# EasyEDA Pro project ProPrj_LED闪烁电路_2025-12-14-09-43-45.epro

# Schematic Schematic1
Board Name: Board1; Create Date: 2025-11-30; Page Name: P1; Project Name: LED闪烁电路; Schematic Name: Schematic1; Update Date: 2025-11-30; Company: 嘉立创EDA; Page Size: A4; Version: V1.0
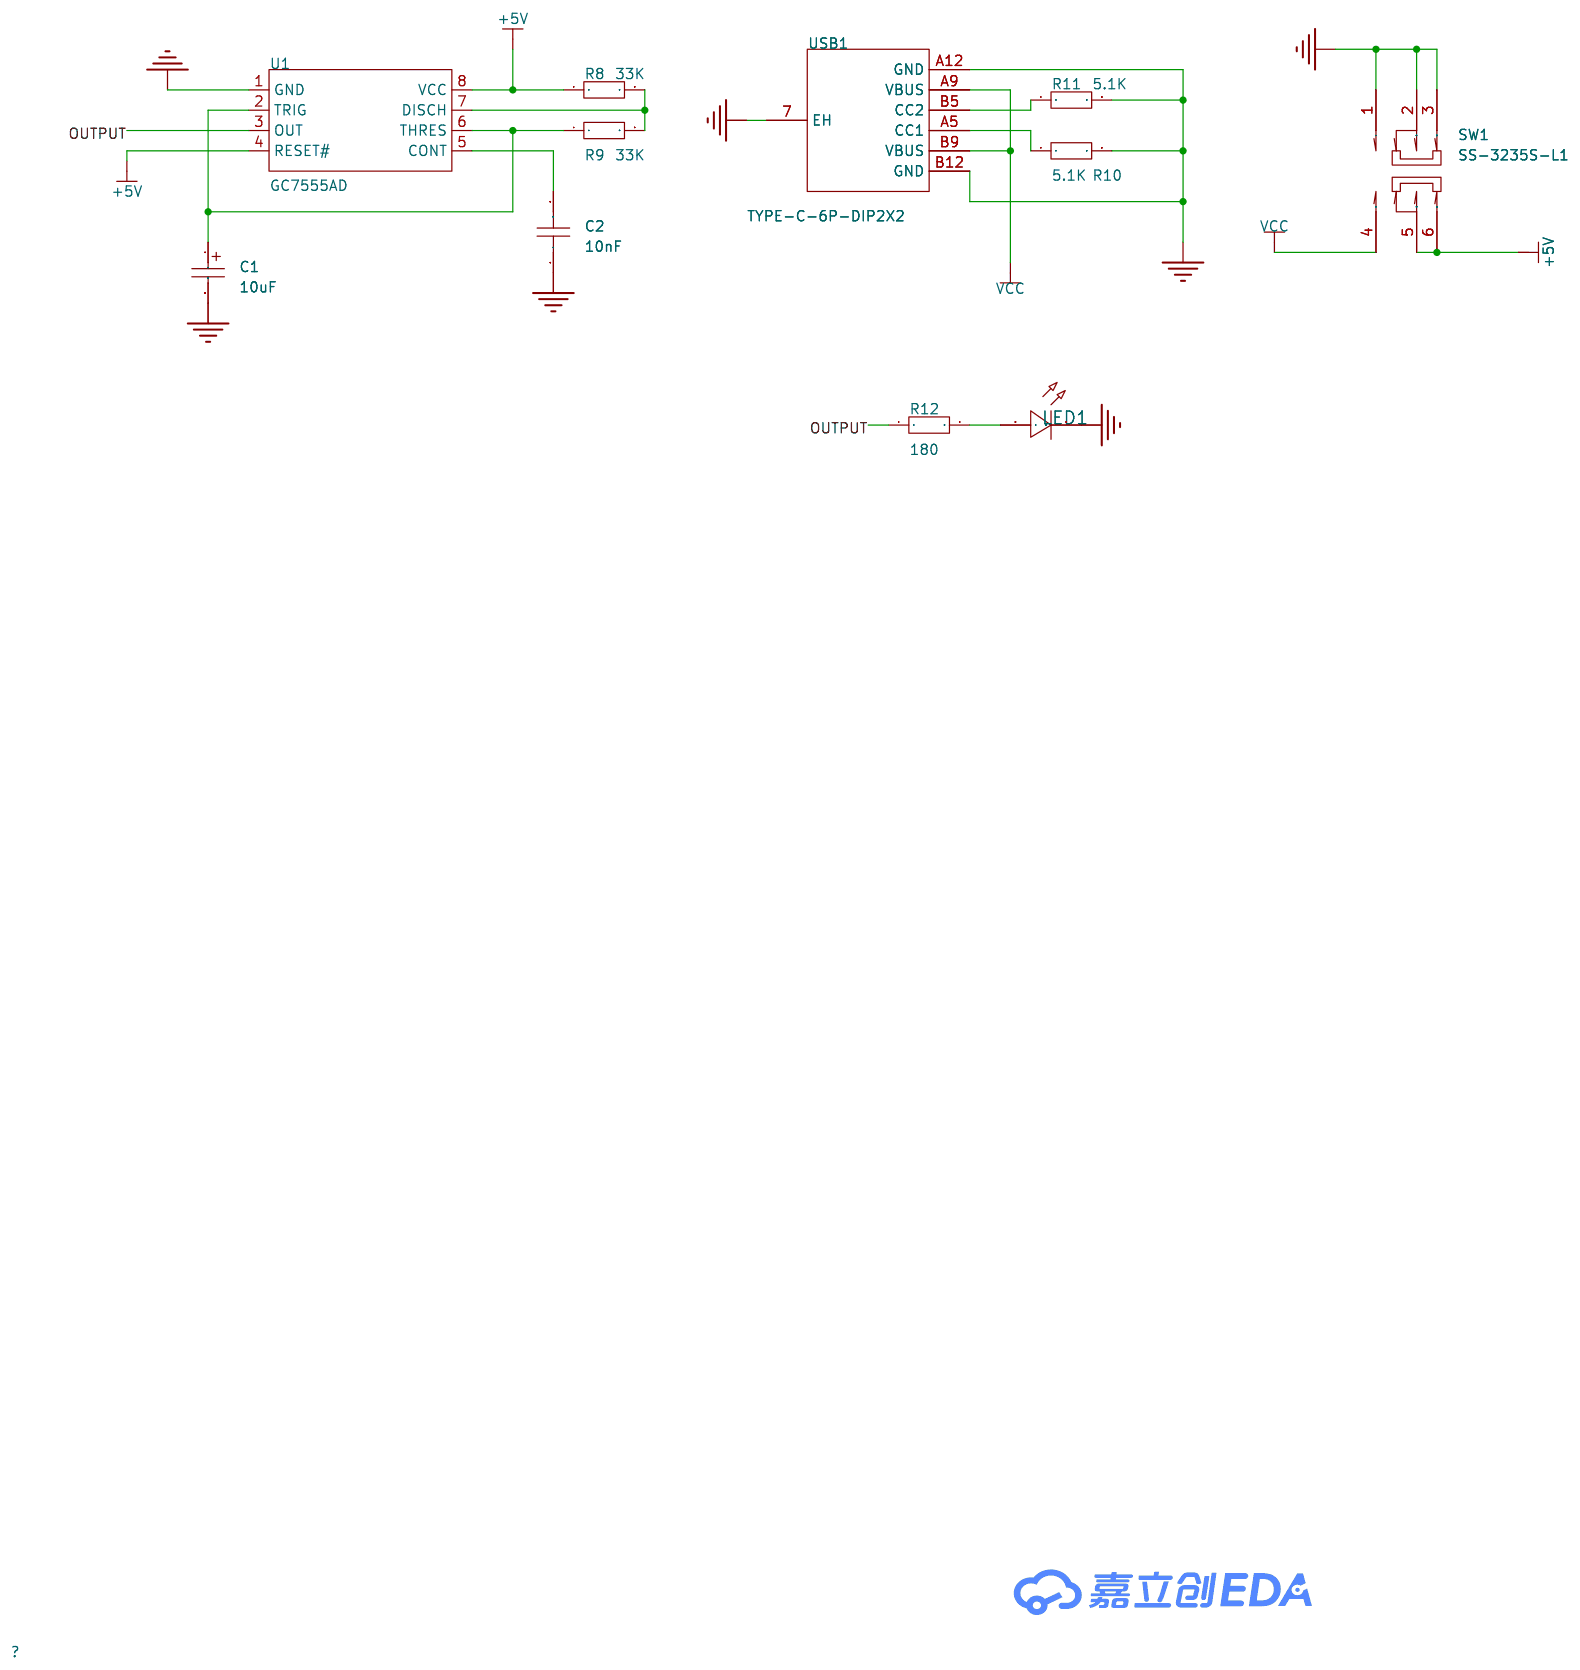
[diagram p0: schematic sheet]

## Parts
C1  10uF  [C_Ele_SMD_3x5.4mm]
C2  10nF  [C0603]
LED1  -  [LED_0603]
R8  33K  [R0603]
R9  33K  [R0603]
R10  5.1K  [R0603]
R11  5.1K  [R0603]
R12  180  [R0603]
SW1  SS-3235S-L1  [SW-SMD_SS-3235S-LX]
U1  GC7555AD  [PDIP-8_L9.5-W6.4-P2.54-LS7.6-BL]
USB1  TYPE-C-6P-DIP2X2  [TYPE-C-SMD_TYPE-C-6P]

## Library data of the parts
C1 = C_Ele_SMD_3x5.4mm: Supplier Footprint: SMD,3x5.4mm
C2 = CAP_0603: Supplier Footprint: 0603
LED1 = LED_0603-R: Supplier Footprint: 0603
R8-R12 = Res_0603: Supplier Footprint: 0603
SW1 = SS-3235S-L1: 电路结构:双刀双掷;安装方式:卧贴;开关颜色:黑色;额定电流:50mA;额定电压:12V;工作寿命:1万次;; LCSC Part Name: 柄长2mm 卧贴双档 滑动开关; Supplier Part: C500055; Manufacturer: XKB Connection(中国星坤); Supplier Footprint: SMD,9.1x3.6mm; JLCPCB Part Class: 扩展库; Datasheet: https://item.szlcsc.com/datasheet/SS-3235S-L1/512181.html; Supplier: LCSC; Circuit: 双刀双掷; Actuator Style: 矩形柱状; Termination Style: 鸥翼型; Length: 9.1mm; Width: 3.55mm; Switch Height: 3.2mm; Mounting Type: 卧贴; Actuator Color: 黑色; Current Rating: 50mA; Voltage Rating: 12V; Life: 1万次; Operating Temperature: -40℃~+85℃
U1 = GC7555AD: 通用计时器：时基电路；计时；脉冲产生；满足用户（至少工业级）自主可控的需求。; Supplier Part: C5274770; Manufacturer: Sungine(双竞集成); Supplier Footprint: DIP-8; JLCPCB Part Class: 扩展库; Datasheet: https://item.szlcsc.com/datasheet/GC7555AD/6005908.html; Supplier: LCSC
USB1 = TYPE-C-6P-DIP2X2: Supplier Part: C9900017627; Supplier Footprint: TYPE-C-6P; JLCPCB Part Class: 扩展库; Supplier: LCSC

## Nets
+5V: R8.1 SW1.5 SW1.6 U1.4(RESET#) U1.8(VCC)
GND: C1.2 C2.1 LED1.1(C) R10.2 R11.2 SW1.1 SW1.2 SW1.3 U1.1(GND) USB1.7(EH) USB1.A12(GND) USB1.B12(GND)
VCC: SW1.4 USB1.A9(VBUS) USB1.B9(VBUS)
OUTPUT: R12.1 U1.3(OUT)
$1N378: C1.1 R9.1 U1.2(TRIG) U1.6(THRES)
$1N428: R8.2 R9.2 U1.7(DISCH)
$1N596: C2.2 U1.5(CONT)
$1N821: R11.1 USB1.B5(CC2)
$1N826: R10.1 USB1.A5(CC1)
$1N1391: LED1.2(A) R12.2

# Board PCB1
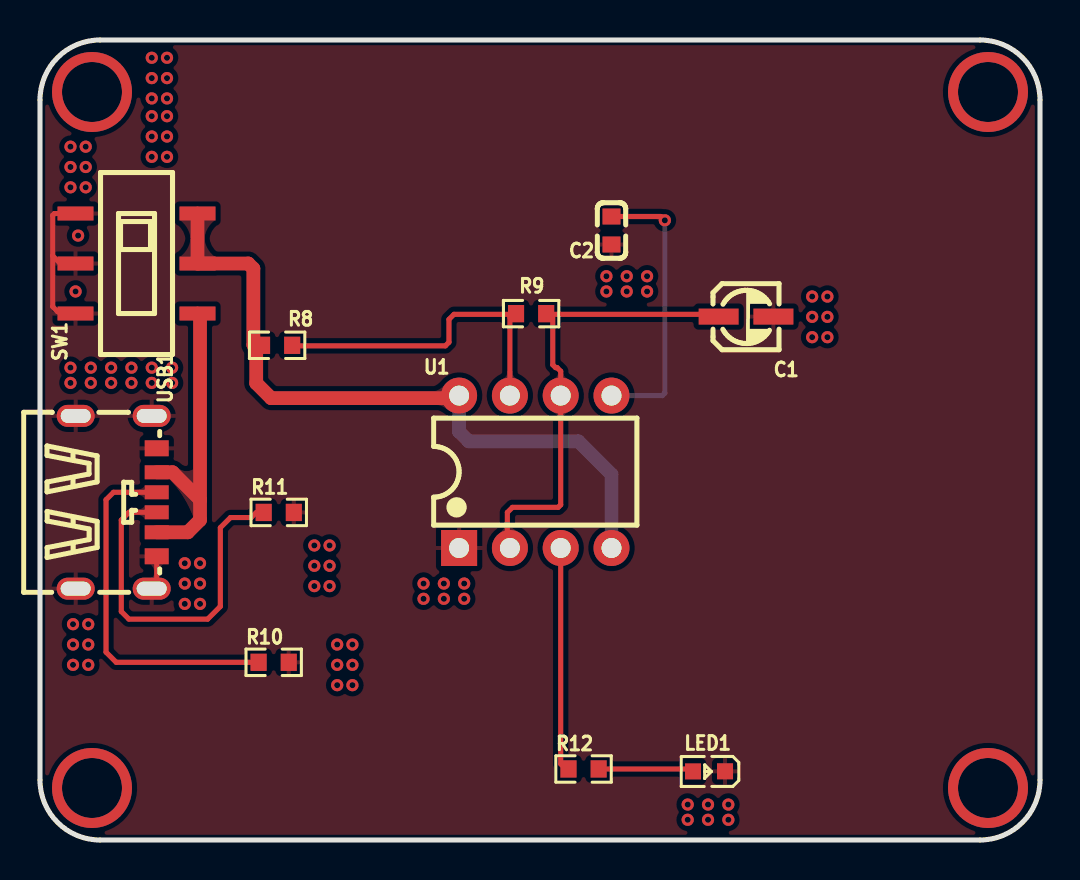
[diagram p1: board, top side]
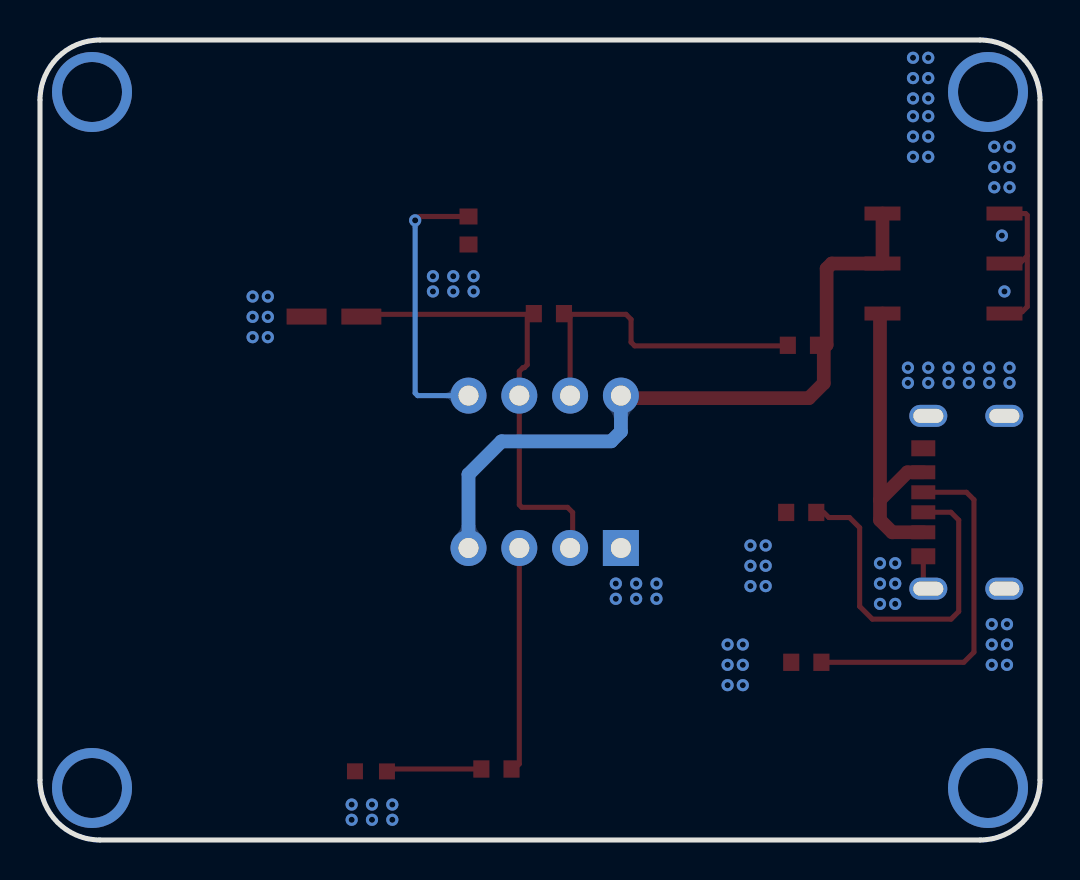
[diagram p2: board, bottom side, seen from below]

Outline 50 x 40 mm; copper layers: Top Layer, Bottom Layer. Coordinates in mm from the lower left corner of the outline.
Outline path: 0,37 0,3 arc(0.88,0.88) 3,0 47,0 arc(49.12,0.88) 50,3 50,37 arc(49.12,39.12) 47,40 3,40 arc(0.88,39.12) 0,37
Stack: Top Layer 0.035mm / Dielectric1 1.51mm FR4 er 4.5 / Bottom Layer 0.035mm

## Design rules (mm)
template: JLCPCB Capability(Two Layers Board)
spacing copperThickness1oz (default): track to track 0.102, other pairs 0.152 to 0.3
spacing copperThickness2oz: track to track 0.203, other pairs 0.152 to 0.3
track width copperThickness1oz (default): min 0.127, default 0.254, max 2.54
track width copperThickness2oz: min 0.203, default 0.254, max 2.54
differential pair differentialPair (default): width min 0.127, default 0.254, max 2.54; gap min 0.152, default 0.152
via viaSize (default): diameter min 0.5, default 0.61, max 10; hole min 0.3, default 0.305, max 6.3

## Placement (name value [footprint] x y rotation side)
C1  10uF  [C_Ele_SMD_3x5.4mm]  35.31 26.16 180 top
C2  10nF  [C0603]  28.57 30.47 90 top
LED1  NCD0603Y2  [LED_0603]  33.4 3.42 180 top
R8  33K  [R0603]  11.86 24.74 0 top
R9  33K  [R0603]  24.56 26.32 180 top
R10  5.1K  [R0603]  11.68 8.89 0 top
R11  5.1K  [R0603]  11.94 16.38 0 top
R12  180  [R0603]  27.18 3.55 0 top
SW1  SS-3235S-L1  [SW-SMD_SS-3235S-LX]  4.83 28.82 90 top
U1  GC7555AD  [PDIP-8_L9.5-W6.4-P2.54-LS7.6-BL]  24.76 18.41 0 top
USB1  TYPE-C-6P-DIP2X2  [TYPE-C-SMD_TYPE-C-6P]  3.81 16.89 270 top

## Footprints (pads in the part's own frame, mm; a bottom-side part is the same pattern mirrored in y, then rotated)
C0603
  rect 0.8x0.9 smd: 1(-0.7,0) 2(0.7,0)
C_Ele_SMD_3x5.4mm
  rect 1.999x0.8 smd: 1(1.374,-0.014) 2(-1.364,-0.014)
LED_0603
  rect 0.8x0.8 smd: 1(-0.851,-0.01) 2(0.75,-0.005)
PDIP-8_L9.5-W6.4-P2.54-LS7.6-BL
  rect 1.8x1.8 hole 1: 1(-3.81,-3.81)
  round 1.8 hole 1: 2(-1.27,-3.81) 3(1.27,-3.81) 4(3.81,-3.81) 5(3.81,3.81) 6(1.27,3.81) 7(-1.27,3.81) 8(-3.81,3.81)
R0603
  rect 0.806x0.864 smd: 1(-0.753,0) 2(0.753,0)
SW-SMD_SS-3235S-LX
  rect 0.7x1.8 smd: 1(-2.5,3.05) 2(0,3.05) 3(2.5,3.05) 4(-2.5,-3.05) 5(0,-3.05) 6(2.5,-3.05)
TYPE-C-SMD_TYPE-C-6P
  oval 1.1x1.9 hole 0.7x1.5: 7(-4.32,1.775) 7(-4.32,-2.025) 7(4.32,1.775) 7(4.32,-2.025)
  rect 0.7x1.2 smd: A5(-0.5,2.025) A9(1.5,2.025) B5(0.5,2.025) B9(-1.5,2.025)
  rect 0.8x1.2 smd: A12(2.7,2.025) B12(-2.7,2.025)

## Nets
As in the schematic.

## Via types
v1: diameter 0.61, hole 0.305, Top Layer to Bottom Layer, 81 vias
v2: diameter 4, hole 3, Top Layer to Bottom Layer, 4 vias

## Routing (per net, layer and track width the routed paths; a pad name or vN(x,y) marks a point on that pad's centre or on a via; arc(x,y) is an arc through that point)
+5V: length 35.8
  Top Layer w0.686: SW1.6 SW1.5 10.41,28.82 10.67,28.57 10.67,24.76 10.81,24.76 10.81,22.84 11.56,22.09 20.83,22.09 20.96,22.22
  Bottom Layer w0.686: 20.96,22.22 20.96,20.42 21.44,19.93 26.92,19.93 28.57,18.28 U1.4
GND: length 9.4
  Top Layer w0.254: 0.64,29.2 0.64,31.24 0.72,31.32 SW1.3 ; 0.64,29.2 1.02,28.82 SW1.2 ; 0.64,29.2 0.64,26.67 0.89,26.41 1.69,26.41 SW1.1 ; USB1.A12 5.83,13.08
VCC: length 15.5
  Top Layer w0.686: 8,17.01 8,26.2 SW1.4 ; 8,17.01 6.63,18.39 USB1.B9 ; 8,17.01 8,16 7.39,15.39 USB1.A9
(no net):
  vias: v1(1.52,34.67) v1(1.52,33.65) v1(1.52,32.63) v1(1.52,23.62) v1(1.52,22.86) v1(1.65,10.79) v1(1.65,9.77) v1(1.65,8.76) v1(1.78,27.43) v1(1.91,30.22) v1(2.29,34.67) v1(2.29,33.65) v1(2.29,32.63) v1(2.41,10.79) v1(2.41,9.77) v1(2.41,8.76) v1(2.54,23.62) v1(2.54,22.86) v1(3.56,23.62) v1(3.56,22.86) v1(4.57,23.62) v1(4.57,22.86) v1(5.59,39.11) v1(5.59,38.09) v1(5.59,37.08) v1(5.59,36.19) v1(5.59,35.17) v1(5.59,34.16) v1(5.59,23.62) v1(5.59,22.86) v1(6.35,39.11) v1(6.35,38.09) v1(6.35,37.08) v1(6.35,36.19) v1(6.35,35.17) v1(6.35,34.16) v1(6.6,23.62) v1(6.6,22.86) v1(7.24,13.84) v1(7.24,12.82) v1(7.24,11.81) v1(8,13.84) v1(8,12.82) v1(8,11.81) v1(13.72,14.73) v1(13.72,13.71) v1(13.72,12.69) v1(14.48,14.73) v1(14.48,13.71) v1(14.48,12.69) v1(14.86,9.77) v1(14.86,8.76) v1(14.86,7.74) v1(15.62,9.77) v1(15.62,8.76) v1(15.62,7.74) v1(19.18,12.82) v1(19.18,12.06) v1(20.19,12.82) v1(20.19,12.06) v1(21.21,12.82) v1(21.21,12.06) v1(28.32,28.19) v1(28.32,27.43) v1(29.34,28.19) v1(29.34,27.43) v1(30.35,28.19) v1(30.35,27.43) v1(32.38,1.77) v1(32.38,1.01) v1(33.4,1.77) v1(33.4,1.01) v1(34.42,1.77) v1(34.42,1.01) v1(38.61,27.17) v1(38.61,26.16) v1(38.61,25.14) v1(39.37,27.17) v1(39.37,26.16) v1(39.37,25.14) v2(2.6,37.4) v2(2.6,2.6) v2(47.4,37.4) v2(47.4,2.6)
OUTPUT: length 11.1
  Top Layer w0.254: 26.18,3.55 26.18,3.66 26.03,3.81 U1.3
$1N378: length 22.7
  Top Layer w0.254: 33.93,26.17 33.82,26.28 25.64,26.28 25.64,23.76 25.78,23.62 25.86,23.62 26.03,23.44 U1.6 26.03,16.76 25.91,16.63 23.62,16.63 23.37,16.38 23.37,14.73 23.5,14.6
$1N428: length 16.3
  Top Layer w0.254: 23.5,22.22 23.5,26.14 23.64,26.28 20.7,26.28 20.45,26.03 20.45,24.89 20.27,24.71 12.86,24.71 12.81,24.76
$1N596: length 14.1
  Top Layer w0.254: C2.2 31.05,31.17 v1(31.24,30.98)
  Bottom Layer w0.254: U1.5 31.12,22.22 31.24,22.35 v1(31.24,30.98)
$1N821: length 17.9
  Top Layer w0.254: 10.81,16.38 10.56,16.12 9.53,16.12 9.02,15.62 9.02,11.68 8.38,11.04 4.44,11.04 4.06,11.42 4.06,16 4.45,16.39 USB1.B5
$1N826: length 17.9
  Top Layer w0.254: 10.68,8.89 3.81,8.89 3.3,9.39 3.3,17.01 3.67,17.39 USB1.A5
$1N1391: length 4.5
  Top Layer w0.254: 28.18,3.55 32.53,3.55 LED1.2

## Copper pours and planes (outline as drawn; the poured copper is in the pictures)
GND on Top Layer: -3.3,42.79 52.07,42.79 52.07,-2.04 -3.3,-2.04
GND on Bottom Layer: -6.1,39.75 52.83,39.75 52.83,-6.48 -6.1,-6.48

Small or netless copper shapes (teardrops, artwork), in the pictures only: 16 on Top Layer, 4 on Bottom Layer
